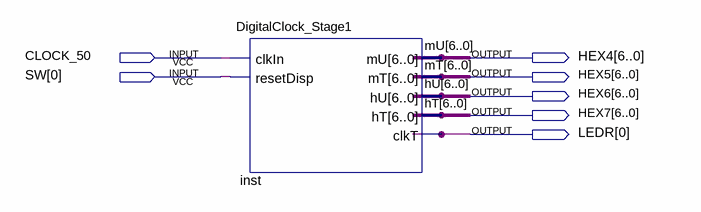
[diagram p0: schematic sheet]
// Quartus schematic DigitalClock.bdf as structural Verilog: 1 symbols, 7 pins
module DigitalClock (
  input  CLOCK_50,
  input  [0:0] SW,
  output [6:0] HEX4,
  output [6:0] HEX5,
  output [6:0] HEX6,
  output [6:0] HEX7,
  output [0:0] LEDR
);

  DigitalClock_Stage1 inst (
    .clkIn(CLOCK_50), .resetDisp(SW[0]), .mU(HEX4), .mT(HEX5), .hU(HEX6), .hT(HEX7), .clkT(LEDR[0]));

  // Other names for the same wires on the sheet: hT[6:0] = HEX7; hU[6:0] = HEX6; mT[6:0] = HEX5; mU[6:0] = HEX4
endmodule
